# Altium schematic sheet uart.SchDoc
size A3; DocumentNumber: 8; SheetNumber: 8; SheetTotal: 45; SheetDescription: UART Communication
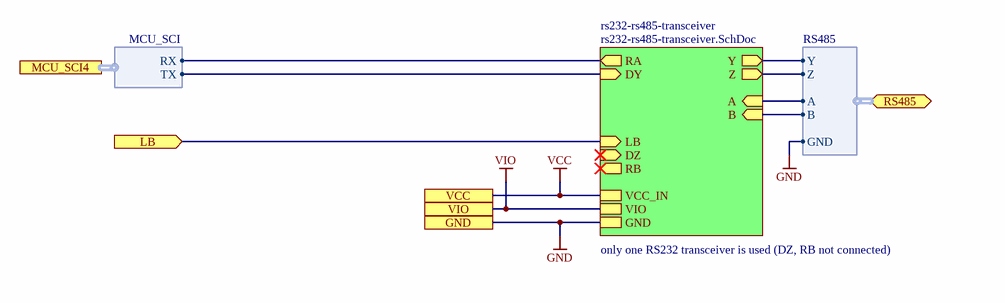
[diagram p0: uart.SchDoc]

## Sub-sheets
rs232-rs485-transceiver = rs232-rs485-transceiver.SchDoc: GND, Z (out), Y (out), B (in), RA (out), DZ (in), A (in), RB (out), DY (in), LB (in), VCC_IN, VIO

## Ports
GND, LB (in), MCU_SCI4 (harness MCU_SCI), RS485 (bidir, harness RS485), VCC, VIO

## Harnesses
RS485: Y, Z, A, B, GND
MCU_SCI: RX, TX

## Nets
GND: port GND, sheet rs232-rs485-transceiver/GND, port RS485.GND
VCC: port VCC, sheet rs232-rs485-transceiver/VCC_IN
VIO: port VIO, sheet rs232-rs485-transceiver/VIO
LB: port LB, sheet rs232-rs485-transceiver/LB
(unnamed): sheet rs232-rs485-transceiver/Z, port RS485.Z
(unnamed): sheet rs232-rs485-transceiver/Y, port RS485.Y
(unnamed): sheet rs232-rs485-transceiver/B, port RS485.B
(unnamed): sheet rs232-rs485-transceiver/RA, port MCU_SCI4.RX
(unnamed): sheet rs232-rs485-transceiver/A, port RS485.A
(unnamed): sheet rs232-rs485-transceiver/DY, port MCU_SCI4.TX

## Notes on the sheet
- only one RS232 transceiver is used (DZ, RB not connected)
- Fraunhofer IISB
- Schottkystr. 10
- developed by:
- 91058 Erlangen
- Germany
- Author
- Project
- License
- Description
- File
- Version
- Release Date
- Sheet
- foxbms.org <https://foxbms.org>
- www.iisb.fraunhofer.de <https://www.iisb.fraunhofer.de/>
- foxBMS Team
- /